# Altium schematic sheet Control_Board.SchDoc
size A4
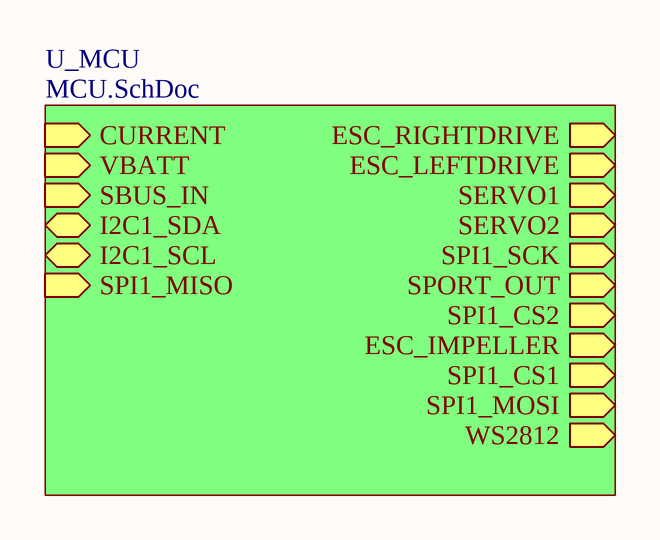
[diagram p0: Control_Board.SchDoc]

## Sub-sheets
U_MCU = MCU.SchDoc: ESC_RIGHTDRIVE (out), ESC_LEFTDRIVE (out), CURRENT (in), VBATT (in), SERVO1 (out), SERVO2 (out), SPI1_SCK (out), SPORT_OUT (out), SBUS_IN (in), SPI1_CS2 (out), I2C1_SDA (bidir), I2C1_SCL (bidir), ESC_IMPELLER (out), SPI1_CS1 (out), SPI1_MOSI (out), SPI1_MISO (in), WS2812 (out)